# Altium schematic sheet PowerBoardOld.SchDoc: DriveHUB CardFrame - Backplane Power
size A3; Date: 01/08/22; Engineer: AJC; DocumentNumber: 35-735; Revision: D; SheetNumber: 1; SheetTotal: 3; Manager: AJC
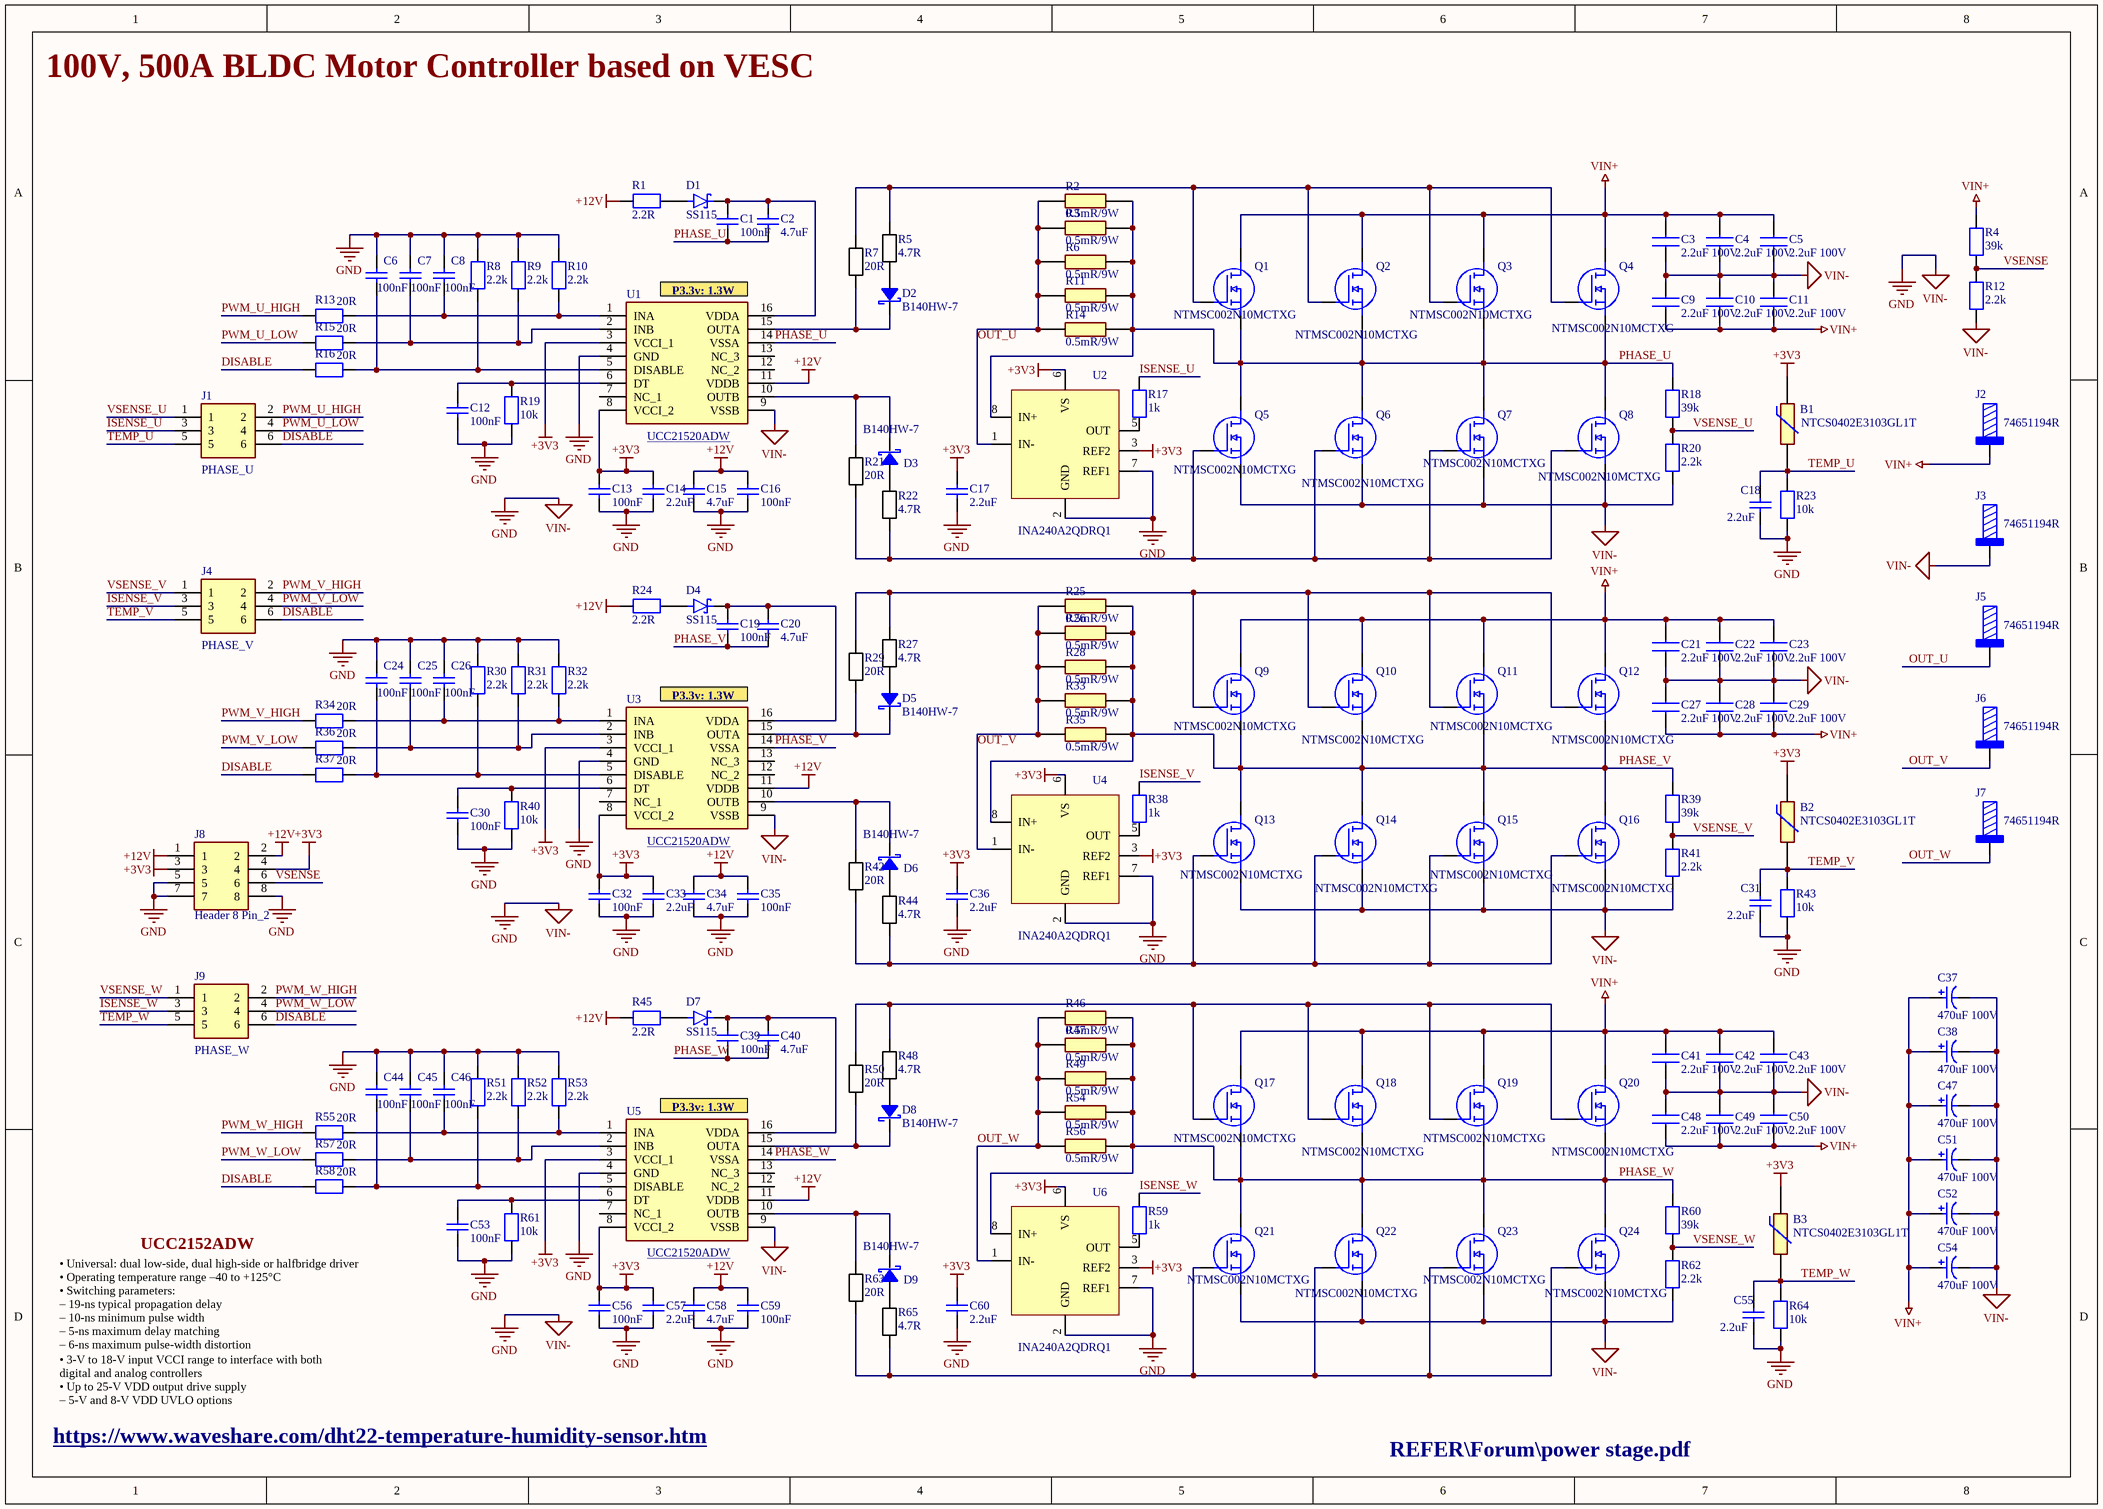
[diagram p0: PowerBoardOld.SchDoc]

## Parts
B1  NTCS0402E3103GL1T  [THRMC1005X65N]
B2  NTCS0402E3103GL1T  [THRMC1005X65N]
B3  NTCS0402E3103GL1T  [THRMC1005X65N]
C1  100nF  [C0402]
C2  4.7uF  [C0603]
C3  2.2uF 100V  [CAPC3216X178N]
C4  2.2uF 100V  [CAPC3216X178N]
C5  2.2uF 100V  [CAPC3216X178N]
C6  100nF  [C0402]
C7  100nF  [C0402]
C8  100nF  [C0402]
C9  2.2uF 100V  [CAPC3216X178N]
C10  2.2uF 100V  [CAPC3216X178N]
C11  2.2uF 100V  [CAPC3216X178N]
C12  100nF  [C0402]
C13  100nF  [C0402]
C14  2.2uF  [C0603]
C15  4.7uF  [C0603]
C16  100nF  [C0402]
C17  2.2uF  [C0603]
C18  2.2uF  [C0603]
C19  100nF  [C0402]
C20  4.7uF  [C0603]
C21  2.2uF 100V  [CAPC3216X178N]
C22  2.2uF 100V  [CAPC3216X178N]
C23  2.2uF 100V  [CAPC3216X178N]
C24  100nF  [C0402]
C25  100nF  [C0402]
C26  100nF  [C0402]
C27  2.2uF 100V  [CAPC3216X178N]
C28  2.2uF 100V  [CAPC3216X178N]
C29  2.2uF 100V  [CAPC3216X178N]
C30  100nF  [C0402]
C31  2.2uF  [C0603]
C32  100nF  [C0402]
C33  2.2uF  [C0603]
C34  4.7uF  [C0603]
C35  100nF  [C0402]
C36  2.2uF  [C0603]
C37  470uF 100V  [CAPPRD750W80D1625H4150]
C38  470uF 100V  [CAPPRD750W80D1625H4150]
C39  100nF  [C0402]
C40  4.7uF  [C0603]
C41  2.2uF 100V  [CAPC3216X178N]
C42  2.2uF 100V  [CAPC3216X178N]
C43  2.2uF 100V  [CAPC3216X178N]
C44  100nF  [C0402]
C45  100nF  [C0402]
C46  100nF  [C0402]
C47  470uF 100V  [CAPPRD750W80D1625H4150]
C48  2.2uF 100V  [CAPC3216X178N]
C49  2.2uF 100V  [CAPC3216X178N]
C50  2.2uF 100V  [CAPC3216X178N]
C51  470uF 100V  [CAPPRD750W80D1625H4150]
C52  470uF 100V  [CAPPRD750W80D1625H4150]
C53  100nF  [C0402]
C54  470uF 100V  [CAPPRD750W80D1625H4150]
C55  2.2uF  [C0603]
C56  100nF  [C0402]
C57  2.2uF  [C0603]
C58  4.7uF  [C0603]
C59  100nF  [C0402]
C60  2.2uF  [C0603]
D1  SS115  [DIOM4325X250N]
D2  B140HW-7  [SOD123]
D3  B140HW-7  [SOD123]
D4  SS115  [DIOM4325X250N]
D5  B140HW-7  [SOD123]
D6  B140HW-7  [SOD123]
D7  SS115  [DIOM4325X250N]
D8  B140HW-7  [SOD123]
D9  B140HW-7  [SOD123]
J1  PHASE_U  [61300621121]
J2  74651194R  [74651194]
J3  74651194R  [74651194]
J4  PHASE_V  [61300621121]
J5  74651194R  [74651194]
J6  74651194R  [74651194]
J7  74651194R  [74651194]
J8  Header 8 Pin_2  [61300821121]
J9  PHASE_W  [61300621121]
Q1  NTMSC002N10MCTXG  [NTMSC002N10MCTXG]
Q2  NTMSC002N10MCTXG  [NTMSC002N10MCTXG]
Q3  NTMSC002N10MCTXG  [NTMSC002N10MCTXG]
Q4  NTMSC002N10MCTXG  [NTMSC002N10MCTXG]
Q5  NTMSC002N10MCTXG  [NTMSC002N10MCTXG]
Q6  NTMSC002N10MCTXG  [NTMSC002N10MCTXG]
Q7  NTMSC002N10MCTXG  [NTMSC002N10MCTXG]
Q8  NTMSC002N10MCTXG  [NTMSC002N10MCTXG]
Q9  NTMSC002N10MCTXG  [NTMSC002N10MCTXG]
Q10  NTMSC002N10MCTXG  [NTMSC002N10MCTXG]
Q11  NTMSC002N10MCTXG  [NTMSC002N10MCTXG]
Q12  NTMSC002N10MCTXG  [NTMSC002N10MCTXG]
Q13  NTMSC002N10MCTXG  [NTMSC002N10MCTXG]
Q14  NTMSC002N10MCTXG  [NTMSC002N10MCTXG]
Q15  NTMSC002N10MCTXG  [NTMSC002N10MCTXG]
Q16  NTMSC002N10MCTXG  [NTMSC002N10MCTXG]
Q17  NTMSC002N10MCTXG  [NTMSC002N10MCTXG]
Q18  NTMSC002N10MCTXG  [NTMSC002N10MCTXG]
Q19  NTMSC002N10MCTXG  [NTMSC002N10MCTXG]
Q20  NTMSC002N10MCTXG  [NTMSC002N10MCTXG]
Q21  NTMSC002N10MCTXG  [NTMSC002N10MCTXG]
Q22  NTMSC002N10MCTXG  [NTMSC002N10MCTXG]
Q23  NTMSC002N10MCTXG  [NTMSC002N10MCTXG]
Q24  NTMSC002N10MCTXG  [NTMSC002N10MCTXG]
R1  2.2R  [R1206]
R2  0.5mR/9W  [RESC10052X137N]
R3  0.5mR/9W  [RESC10052X137N]
R4  39k  [R0805]
R5  4.7R  [R1206]
R6  0.5mR/9W  [RESC10052X137N]
R7  20R  [R1206]
R8  2.2k  [R0603]
R9  2.2k  [R0603]
R10  2.2k  [R0603]
R11  0.5mR/9W  [RESC10052X137N]
R12  2.2k  [R0805]
R13  20R  [R1206]
R14  0.5mR/9W  [RESC10052X137N]
R15  20R  [R1206]
R16  20R  [R1206]
R17  1k  [R0603]
R18  39k  [R0805]
R19  10k  [R0603]
R20  2.2k  [R0805]
R21  20R  [R1206]
R22  4.7R  [R1206]
R23  10k  [R0603]
R24  2.2R  [R1206]
R25  0.5mR/9W  [RESC10052X137N]
R26  0.5mR/9W  [RESC10052X137N]
R27  4.7R  [R1206]
R28  0.5mR/9W  [RESC10052X137N]
R29  20R  [R1206]
R30  2.2k  [R0603]
R31  2.2k  [R0603]
R32  2.2k  [R0603]
R33  0.5mR/9W  [RESC10052X137N]
R34  20R  [R1206]
R35  0.5mR/9W  [RESC10052X137N]
R36  20R  [R1206]
R37  20R  [R1206]
R38  1k  [R0603]
R39  39k  [R0805]
R40  10k  [R0603]
R41  2.2k  [R0805]
R42  20R  [R1206]
R43  10k  [R0603]
R44  4.7R  [R1206]
R45  2.2R  [R1206]
R46  0.5mR/9W  [RESC10052X137N]
R47  0.5mR/9W  [RESC10052X137N]
R48  4.7R  [R1206]
R49  0.5mR/9W  [RESC10052X137N]
R50  20R  [R1206]
R51  2.2k  [R0603]
R52  2.2k  [R0603]
R53  2.2k  [R0603]
R54  0.5mR/9W  [RESC10052X137N]
R55  20R  [R1206]
R56  0.5mR/9W  [RESC10052X137N]
R57  20R  [R1206]
R58  20R  [R1206]
R59  1k  [R0603]
R60  39k  [R0805]
R61  10k  [R0603]
R62  2.2k  [R0805]
R63  20R  [R1206]
R64  10k  [R0603]
R65  4.7R  [R1206]
U1  UCC21520ADW  [SOIC127P1030X265-16N]
U2  INA240A2QDRQ1  [SOIC127P600X175-8N]
U3  UCC21520ADW  [SOIC127P1030X265-16N]
U4  INA240A2QDRQ1  [SOIC127P600X175-8N]
U5  UCC21520ADW  [SOIC127P1030X265-16N]
U6  INA240A2QDRQ1  [SOIC127P600X175-8N]

## Nets
+3V3: B1.1 B2.1 B3.1 C13.2 C14.2 C17.2 C32.2 C33.2 C36.2 C56.2 C57.2 C60.2 J8.3 J8.4 U1.3(VCCI_1) U1.8(VCCI_2) U2.3(REF2) U2.6(VS) U3.3(VCCI_1) U3.8(VCCI_2) U4.3(REF2) U4.6(VS) U5.3(VCCI_1) U5.8(VCCI_2) U6.3(REF2) U6.6(VS)
+12V: C15.2 C16.2 C34.2 C35.2 C58.2 C59.2 J8.1 J8.2 R1.1 R24.1 R45.1 U1.11(VDDB) U3.11(VDDB) U5.11(VDDB)
GND: C3.1 C4.1 C5.1 C6.2 C7.2 C8.2 C9.2 C10.2 C11.2 C12.1 C13.1 C14.1 C15.1 C16.1 C17.1 C18.1 C21.1 C22.1 C23.1 C24.2 C25.2 C26.2 C27.2 C28.2 C29.2 C30.1 C31.1 C32.1 C33.1 C34.1 C35.1 C36.1 C37.2 C38.2 C41.1 C42.1 C43.1 C44.2 C45.2 C46.2 C47.2 C48.2 C49.2 C50.2 C51.2 C52.2 C53.1 C54.2 C55.1 C56.1 C57.1 C58.1 C59.1 C60.1 J3.1 J8.5 J8.7 J8.8 Q5.SOURCE Q6.SOURCE Q7.SOURCE Q8.SOURCE Q13.SOURCE Q14.SOURCE Q15.SOURCE Q16.SOURCE Q21.SOURCE Q22.SOURCE Q23.SOURCE Q24.SOURCE R8.2 R9.2 R10.2 R12.1 R19.1 R20.1 R23.1 R30.2 R31.2 R32.2 R40.1 R41.1 R43.1 R51.2 R52.2 R53.2 R61.1 R62.1 R64.1 U1.4(GND) U1.9(VSSB) U2.2(GND) U2.7(REF1) U3.4(GND) U3.9(VSSB) U4.2(GND) U4.7(REF1) U5.4(GND) U5.9(VSSB) U6.2(GND) U6.7(REF1)  [also labelled VIN-]
VIN+: C3.2 C4.2 C5.2 C9.1 C10.1 C11.1 C21.2 C22.2 C23.2 C27.1 C28.1 C29.1 C37.1 C38.1 C41.2 C42.2 C43.2 C47.1 C48.1 C49.1 C50.1 C51.1 C52.1 C54.1 J2.1 Q1.DRAIN Q2.DRAIN Q3.DRAIN Q4.DRAIN Q9.DRAIN Q10.DRAIN Q11.DRAIN Q12.DRAIN Q17.DRAIN Q18.DRAIN Q19.DRAIN Q20.DRAIN R4.2
DISABLE: J1.6 J4.6 J9.6 R16.1 R37.1 R58.1
ISENSE_U: J1.3 R17.2
ISENSE_V: J4.3 R38.2
ISENSE_W: J9.3 R59.2
OUT_U: J5.1 R2.1 R3.1 R6.1 R11.1 R14.1 U2.1(IN-)
OUT_V: J6.1 R25.1 R26.1 R28.1 R33.1 R35.1 U4.1(IN-)
OUT_W: J7.1 R46.1 R47.1 R49.1 R54.1 R56.1 U6.1(IN-)
PHASE_U: C1.1 C2.1 Q1.SOURCE Q2.SOURCE Q3.SOURCE Q4.SOURCE Q5.DRAIN Q6.DRAIN Q7.DRAIN Q8.DRAIN R2.2 R3.2 R6.2 R11.2 R14.2 R18.2 U1.14(VSSA) U2.8(IN+)
PHASE_V: C19.1 C20.1 Q9.SOURCE Q10.SOURCE Q11.SOURCE Q12.SOURCE Q13.DRAIN Q14.DRAIN Q15.DRAIN Q16.DRAIN R25.2 R26.2 R28.2 R33.2 R35.2 R39.2 U3.14(VSSA) U4.8(IN+)
PHASE_W: C39.1 C40.1 Q17.SOURCE Q18.SOURCE Q19.SOURCE Q20.SOURCE Q21.DRAIN Q22.DRAIN Q23.DRAIN Q24.DRAIN R46.2 R47.2 R49.2 R54.2 R56.2 R60.2 U5.14(VSSA) U6.8(IN+)
PWM_U_HIGH: J1.2 R13.1
PWM_U_LOW: J1.4 R15.1
PWM_V_HIGH: J4.2 R34.1
PWM_V_LOW: J4.4 R36.1
PWM_W_HIGH: J9.2 R55.1
PWM_W_LOW: J9.4 R57.1
TEMP_U: B1.2 C18.2 J1.5 R23.2
TEMP_V: B2.2 C31.2 J4.5 R43.2
TEMP_W: B3.2 C55.2 J9.5 R64.2
VSENSE: J8.6 R4.1 R12.2
VSENSE_U: J1.1 R18.1 R20.2
VSENSE_V: J4.1 R39.1 R41.2
VSENSE_W: J9.1 R60.1 R62.2
NetC1_2: C1.2 C2.2 D1.C(K) U1.16(VDDA)
NetC6_1: C6.1 R8.1 R16.2 U1.5(DISABLE)
NetC7_1: C7.1 R9.1 R15.2 U1.2(INB)
NetC8_1: C8.1 R10.1 R13.2 U1.1(INA)
NetC12_2: C12.2 R19.2 U1.6(DT)
NetC19_2: C19.2 C20.2 D4.C(K) U3.16(VDDA)
NetC24_1: C24.1 R30.1 R37.2 U3.5(DISABLE)
NetC25_1: C25.1 R31.1 R36.2 U3.2(INB)
NetC26_1: C26.1 R32.1 R34.2 U3.1(INA)
NetC30_2: C30.2 R40.2 U3.6(DT)
NetC39_2: C39.2 C40.2 D7.C(K) U5.16(VDDA)
NetC44_1: C44.1 R51.1 R58.2 U5.5(DISABLE)
NetC45_1: C45.1 R52.1 R57.2 U5.2(INB)
NetC46_1: C46.1 R53.1 R55.2 U5.1(INA)
NetC53_2: C53.2 R61.2 U5.6(DT)
NetD1_A: D1.A R1.2
NetD2_A: D2.A R5.1
NetD2_C: D2.C R7.1 U1.15(OUTA)
NetD3_A: D3.A R22.2
NetD3_C: D3.C R21.2 U1.10(OUTB)
NetD4_A: D4.A R24.2
NetD5_A: D5.A R27.1
NetD5_C: D5.C R29.1 U3.15(OUTA)
NetD6_A: D6.A R44.2
NetD6_C: D6.C R42.2 U3.10(OUTB)
NetD7_A: D7.A R45.2
NetD8_A: D8.A R48.1
NetD8_C: D8.C R50.1 U5.15(OUTA)
NetD9_A: D9.A R65.2
NetD9_C: D9.C R63.2 U5.10(OUTB)
NetQ1_GATE: Q1.GATE Q2.GATE Q3.GATE Q4.GATE R5.2 R7.2
NetQ5_GATE: Q5.GATE Q6.GATE Q7.GATE Q8.GATE R21.1 R22.1
NetQ9_GATE: Q9.GATE Q10.GATE Q11.GATE Q12.GATE R27.2 R29.2
NetQ13_GATE: Q13.GATE Q14.GATE Q15.GATE Q16.GATE R42.1 R44.1
NetQ17_GATE: Q17.GATE Q18.GATE Q19.GATE Q20.GATE R48.2 R50.2
NetQ21_GATE: Q21.GATE Q22.GATE Q23.GATE Q24.GATE R63.1 R65.1
NetR17_1: R17.1 U2.5(OUT)
NetR38_1: R38.1 U4.5(OUT)
NetR59_1: R59.1 U6.5(OUT)

Not connected (* = marked no-connect by the designer): U1 7(NC_1) 12(NC_2) 13(NC_3); U3 7(NC_1) 12(NC_2) 13(NC_3); U5 7(NC_1) 12(NC_2) 13(NC_3)

## Notes on the sheet
- 100V, 500A BLDC Motor Controller based on VESC
- (near U1) P3.3v: 1.3W
- (near U3) P3.3v: 1.3W
- (near U5) P3.3v: 1.3W
- UCC2152ADW
- • Universal: dual low-side, dual high-side or halfbridge driver
  • Operating temperature range –40 to +125°C
  • Switching parameters:
  – 19-ns typical propagation delay
  – 10-ns minimum pulse width
  – 5-ns maximum delay matching
  – 6-ns maximum pulse-width distortion
- https://www.waveshare.com/dht22-temperature-humidity-sensor.htm
- • 3-V to 18-V input VCCI range to interface with both
  digital and analog controllers
  • Up to 25-V VDD output drive supply
  – 5-V and 8-V VDD UVLO options
- REFER\Forum\power stage.pdf

## Library data of the parts
B1-B3 = NTCS0402E3103GL1T: NTC Thermistors 10Kohms 2% AEC-Q200; Manufacturer: Vishay; Supplier Part Number: 594-NTCS402E3103GL1T; Supplier: Mouser; Manufacturer Part Number: NTCS0402E3103GL1T; Price: 0.47; Value: NTCS0402E3103GL1T
C1 C6-C8 C12 C13 C16 C19 C24-C26 C30 C32 C35 C39 C44-C46 C53 C56 C59 = 100nF ± 10% 50V: Manufacturer: Yageo; Manufacturer Part Number: CS0603KRX7R9BB104; Value: 100nF; Supplier: mouser; Supplier Part Number: 603-CS0603KRX79BB104; Price: 0.1
C2 C15 C20 C34 C40 C58 = 4.7uF ± 10% 50V: Manufacturer: Yageo; Manufacturer Part Number: GRM188R61H225ME11J; Value: 4.7uF; Supplier: mouser; Supplier Part Number: 81-GRM188R61H225ME1J; Price: 0.3
C3-C5 C9-C11 C21-C23 C27-C29 C41-C43 C48-C50 = 2.2uF ±10% 100V: Multilayer Ceramic Capacitors MLCC - SMD/SMT 100V 2.2uF X7R 1206 20%TOL HIGH CV; Manufacturer: KYOCERA AVX; Manufacturer Part Number: 12061C225MAT2A; Supplier Part Number: 581-12061C225MAT2A; Supplier: Mouser; Value: 2.2uF 100V; Price: 0.5
C14 C17 C18 C31 C33 C36 C55 C57 C60 = 2.2uF ± 10% 50V: Manufacturer: Yageo; Manufacturer Part Number: GRM188R61H225ME11J; Value: 2.2uF; Supplier: mouser; Supplier Part Number: 81-GRM188R61H225ME1J; Price: 0.3
C37 C38 C47 C51 C52 C54 = 470uF 100V: Aluminum Electrolytic Capacitors - Radial Leaded 100volts 470uF 20% 16X35.5 7.5LS; Manufacturer: Nichicon; Manufacturer Part Number: UHE2A471MHD; Suplier: Mouser; Supplier Part Number: 647-UHE2A471MHD; Price: 2; Value: 470uF 100V
D1 D4 D7 = SS115: Schottky Diodes & Rectifiers 1A, 150V, Schottky Rectifier; Manufacturer: Taiwan Semiconductor; Value: 1A, 150V; Price: 0.34; Supplier: Mouser; Manufacturer Part Number: SS115; Supplier Part Number: 821-SS115
D2 D3 D5 D6 D8 D9 = B140HW-7: Schottky Diodes & Rectifiers 1A, 40V; Value: B140HW-7; Manufacturer Part Number: B140HW-7; Manufacturer: Diodes; Supplier: Mouser; Supplier Part Number: 621-B140HW-7; Price: 0.42
J1 J4 J9 = Header 6 Pin_2: WR-PHD 2.54mm  Dual Pin Header THT 06p Wurth Elektronik WR-PHD Series, Series Number 6130, 2.54mm Pitch 6 Way 2 Row Straight PCB Header, Solder Termination; Value: 61300621121; Supplier Part Number: 710-61300621121; Supplier: Mouser; Manufacturer: Wurth Elektronik; Manufacturer Part Number: 61300621121; Price: 0.57
J2 J3 J5-J7 = 74651194R: WP-THRSH REDCUBE THR with external thread, M4 x 5mm, 85A; Manufacturer: Wurth Elektronik; Surface: Tin; ComponentLink1Description: Website Link; ComponentLink1URL: https://www.we-online.com/redexpert/article/74651194R?ad; ComponentLink2Description: Datasheet Link; ComponentLink2URL: https://www.we-online.com/redexpert/spec/74651194R?ad; Manufacturer Part Number: 74651194R; Category: REDCUBE THR; Match Code: WP-THRSH; Mount: Through Hole Reflow; Operating Temperature Max: 150°C; Operating Temperature Min: -55°C; Packaging: Tape and Reel; Length: 10mm; Width: 10mm; Height: 8.5mm; Material: Brass; Number of Pins: 9; Rated Current: 85A; Thread Length: 5mm; Thread Size: M4; Supplier: Mouser; Supplier Part Number: 710-74651195R; Price: 3.5; Value: 74651194R
J8 = Header 8 Pin_2: Headers & Wire Housings WR-PHD 2.54mm Hdr 8P Dual Str Gold; Manufacturer: Wurth Elektronik; Value: 61300821121; Supplier Part Number: 710-61300621121; Supplier: Mouser; Manufacturer Part Number: 61300821121; Price: 0.7
Q1-Q24 = NTMSC002N10MCTXG: MOSFET Single N-Channel Power MOSFET 100V, 236A, 2.0mohm; Manufacturer: Onsemi; Manufacturer Part Number: NTMTSC002N10MCTXG; Supplier Part Number: 863-TMTSC002N10MCTXG; Supplier: Mouser; Price: 5.9; Value: NTMSC002N10MCTXG
R1 R24 R45 = 2.2ohm 0.25W ±1%: 2.2 ohm 0.25W ±1%; Manufacturer Part Number: RC1206FR-072R2L; Manufacturer: Yageo; Value: 2.2R; Supplier: Mouser; Supplier Part Number: 603-RC1206FR-072R2L; Price: 0.12
R2 R3 R6 R11 R14 R25 R26 R28 R33 R35 R46 R47 R49 R54 R56 = CSS2H-3920R-L500FE: Current Sense Resistors - SMD 0.5mOHMS 9W 1% AEC-Q200; Manufacturer: Bourns; Value: 0.5ohm 9W; Supplier Part Number: 652-CSS2H3920RL500FE; Supplier: Mouser; Manufacturer Part Number: CSS2H-3920R-L500FE; Price: 2
R4 R18 R39 R60 = 39 kOhms ±1% 0.8W: Manufacturer: Yageo; Manufacturer Part Number: RT0805FRE0739KL; Value: 39k; Supplier: mouser; Supplier Part Number: 603-RT0805FRE0739KL; Price: 0.1
R5 R22 R27 R44 R48 R65 = 4.7 ohm 0.25W ±1%: Manufacturer Part Number: RC1206FR-074R7L; Manufacturer: Yageo; Value: 4.7R; Supplier: Mouser; Supplier Part Number: 603-RC1206FR-074R7L; Price: 0.12
R7 R21 R29 R42 R50 R63 = 20 ohm 0.25W ±1%: Manufacturer Part Number: RC1206FR-0720RL; Manufacturer: Yageo; Value: 20R; Supplier: Mouser; Supplier Part Number: 603-RC1206FR-0720RL; Price: 0.12
R8-R10 R30-R32 R51-R53 = 2.2 kOhms ±1% 0.1W: Manufacturer: Yageo; Manufacturer Part Number: RC0603FR-072K2L; Value: 2.2k; Supplier: Mouser; Supplier Part Number: 603-RC0603FR-072K2L; Price: 0.1
R12 R20 R41 R62 = 2.2 kOhms ±1% 0.8W: Manufacturer: Yageo; Manufacturer Part Number: RT0805FRE072K2L; Value: 2.2k; Supplier: mouser; Supplier Part Number: 603-RT0805FRE072K2L; Price: 0.1
R13 R15 R16 R34 R36 R37 R55 R57 R58 = 20ohm 0.25W ±1%: 20 ohm 0.25W ±1%; Manufacturer Part Number: RC1206FR-0720RL; Manufacturer: Yageo; Value: 20R; Supplier: Mouser; Supplier Part Number: 603-RC1206FR-0720RL; Price: 0.12
R17 R38 R59 = 1 kOhms ±1% 0.1W: Manufacturer: Yageo; Manufacturer Part Number: RC0603FR-071KL; Value: 1k; Supplier: Mouser; Supplier Part Number: 603-RC0603FR-071KL; Price: 0.1
R19 R23 R40 R43 R61 R64 = 10 kOhms ±1% 0.1W: Manufacturer: Yageo; Manufacturer Part Number: RC0603FR-0710KL; Value: 10k; Supplier: mouser; Supplier Part Number: 603-RC0603FR-0710KL; Price: 0.1
U1 U3 U5 = UCC21520ADW: 4A/6A, 5.7 kVrms Isolated Dual Channel Gate Driver; Manufacturer: Texas Instruments; Supplier Part Number: 595-UCC21520ADW; Value: UCC21520ADW; Manufacturer Part Number: UCC21520ADW; Price: 7.6; Supplier: Mouser
U2 U4 U6 = INA240A2QDRQ1: Automotive, High/Low Side, Bi-Directional Zer-Drift Current Sense Amp w/ Enhanced PWM Rejection; Manufacturer: Texas Instruments; Supplier Part Number: 595-INA240A2QDRQ1; Supplier: Mouser; Manufacturer Part Number: INA240A2QDRQ1; Price: 3.8; Value: INA240A2QDRQ1